# Altium schematic sheet Ideal Diode (A).SchDoc
size A4; SheetNumber: 4; SheetTotal: 10
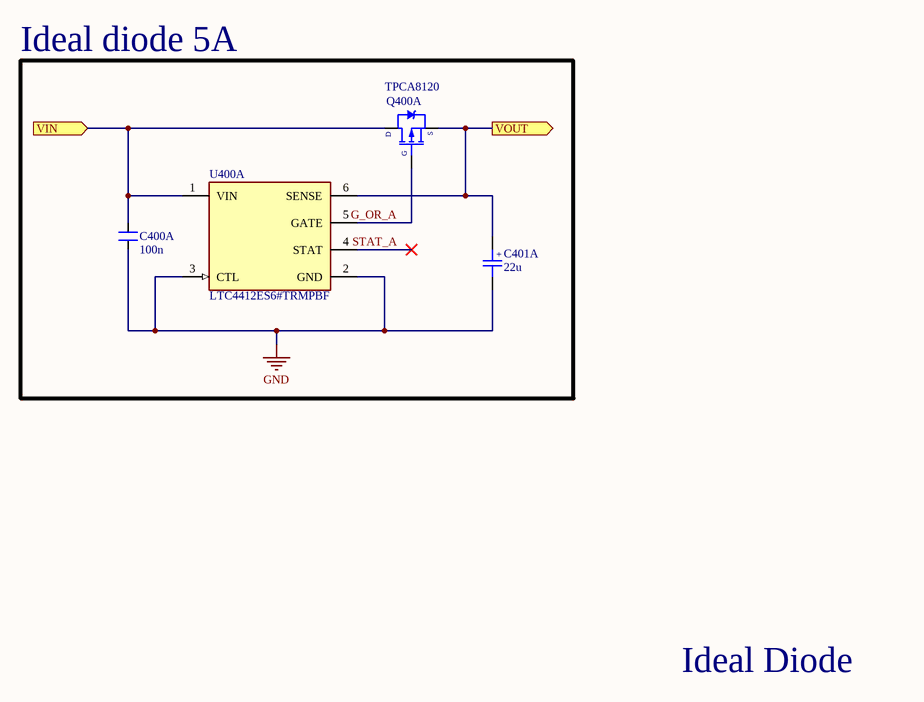
[diagram p0: Ideal Diode (A).SchDoc]

## Parts
C400A  100n  [CN-SMD-0603]
C401A  22u  [CAP_TANT_0603]
Q400A  TPCA8120  [Mosfet P channel]
U400A  LTC4412ES6#TRMPBF  [FP-S6-6-05-08-1636-IPC_C]

## Blocks framed on the sheet
Ideal diode 5A: C400A C401A Q400A U400A

## Ports
VIN (in, see BD[2A]), VOUT (out, see BD[2A])

## Nets
GND: C400A.1 C401A.K U400A.2(GND) U400A.3(CTL)
G_OR_A: Q400A.4(G) U400A.5(GATE)
STAT_A: U400A.4(STAT)
VIN: C400A.2 Q400A.5,6,7,8(D) U400A.1(VIN) ; port VIN
VOUT: C401A.A Q400A.1,2,3(S) U400A.6(SENSE) ; port VOUT

## Notes on the sheet
- Ideal Diode
- (in symbol CAP_TANT_0603) +

## Library data of the parts
C400A = CN: Value: 33pF
C401A = CAP_TANT_0603: Capacitor SMD Tantalum 0603; Manufacturer: *; Manufacturer Part Number: *; Distributor Link: *; LCSC: *
Q400A = Mosfet P channel
U400A = CMP-0479-00425-2: IC OR CTRLR SRC SELECT TSOT23-6; Min Supply Voltage: 2.5V; Max Supply Voltage: 28V; Turn-On Delay Time: 110us; Number of Channels: 1; Lead Free: Lead Free; Length: 2.9mm; Radiation Hardening: No; RoHS Compliant: Yes; Package Quantity: 1; Min Operating Temperature: -40°C; Series: PowerPath™; Packaging: Tape and Reel; Width: 1.75mm; Height: 0.9mm; Number of Pins: 6; Max Operating Temperature: 85°C; Number of Outputs: 1; Case/Package: TSOT; REACH SVHC: No SVHC